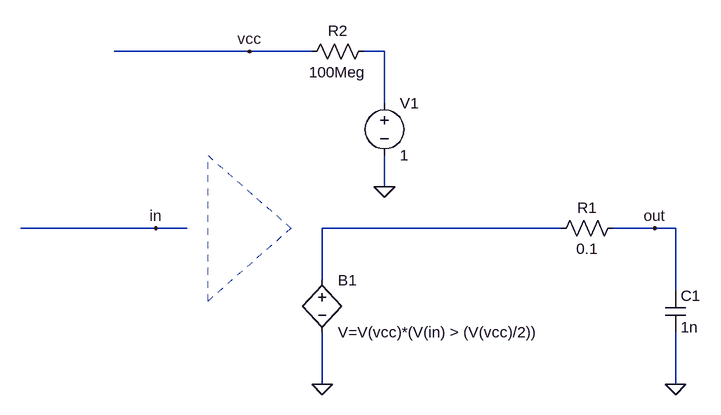
[diagram p0: schematic ideal_logic_buffer.asc]
ideal_logic_buffer.asc, the LTspice schematic file:
Version 4
SHEET 1 1880 680
WIRE 64 -208 -144 -208
WIRE 160 -208 64 -208
WIRE 272 -208 240 -208
WIRE 272 -128 272 -208
WIRE 272 0 272 -48
WIRE -80 64 -288 64
WIRE -32 64 -80 64
WIRE 544 64 176 64
WIRE 688 64 624 64
WIRE 720 64 688 64
WIRE 176 144 176 64
WIRE 720 160 720 64
WIRE 176 304 176 224
WIRE 720 304 720 224
FLAG -80 64 in
FLAG 176 304 0
FLAG 688 64 out
FLAG 64 -208 vcc
FLAG 720 304 0
FLAG 272 0 0
SYMBOL bv 176 128 R0
SYMATTR InstName B1
SYMATTR Value V=V(vcc)*(V(in) > (V(vcc)/2))
SYMBOL res 640 48 R90
WINDOW 0 0 56 VBottom 2
WINDOW 3 32 56 VTop 2
SYMATTR InstName R1
SYMATTR Value 0.1
SYMBOL cap 704 160 R0
SYMATTR InstName C1
SYMATTR Value 1n
SYMBOL voltage 272 -144 R0
SYMATTR InstName V1
SYMATTR Value 1
SYMBOL res 256 -224 R90
WINDOW 0 0 56 VBottom 2
WINDOW 3 32 56 VTop 2
SYMATTR InstName R2
SYMATTR Value 100Meg
LINE Normal 0 176 0 -48 2
LINE Normal 128 64 0 176 2
LINE Normal 0 -48 128 64 2
LINE Normal 0 -48 0 -48 2

The netlist it stands for:
* ideal_logic_buffer.asc
B1 N002 0 V=V(vcc)*(V(in) > (V(vcc)/2))
R1 out N002 0.1
C1 out 0 1n
V1 N001 0 1
R2 N001 vcc 100Meg
.backanno
.end